# EasyEDA Pro project 2025NUEDC_A_Project.eprj, board PCB_互感器
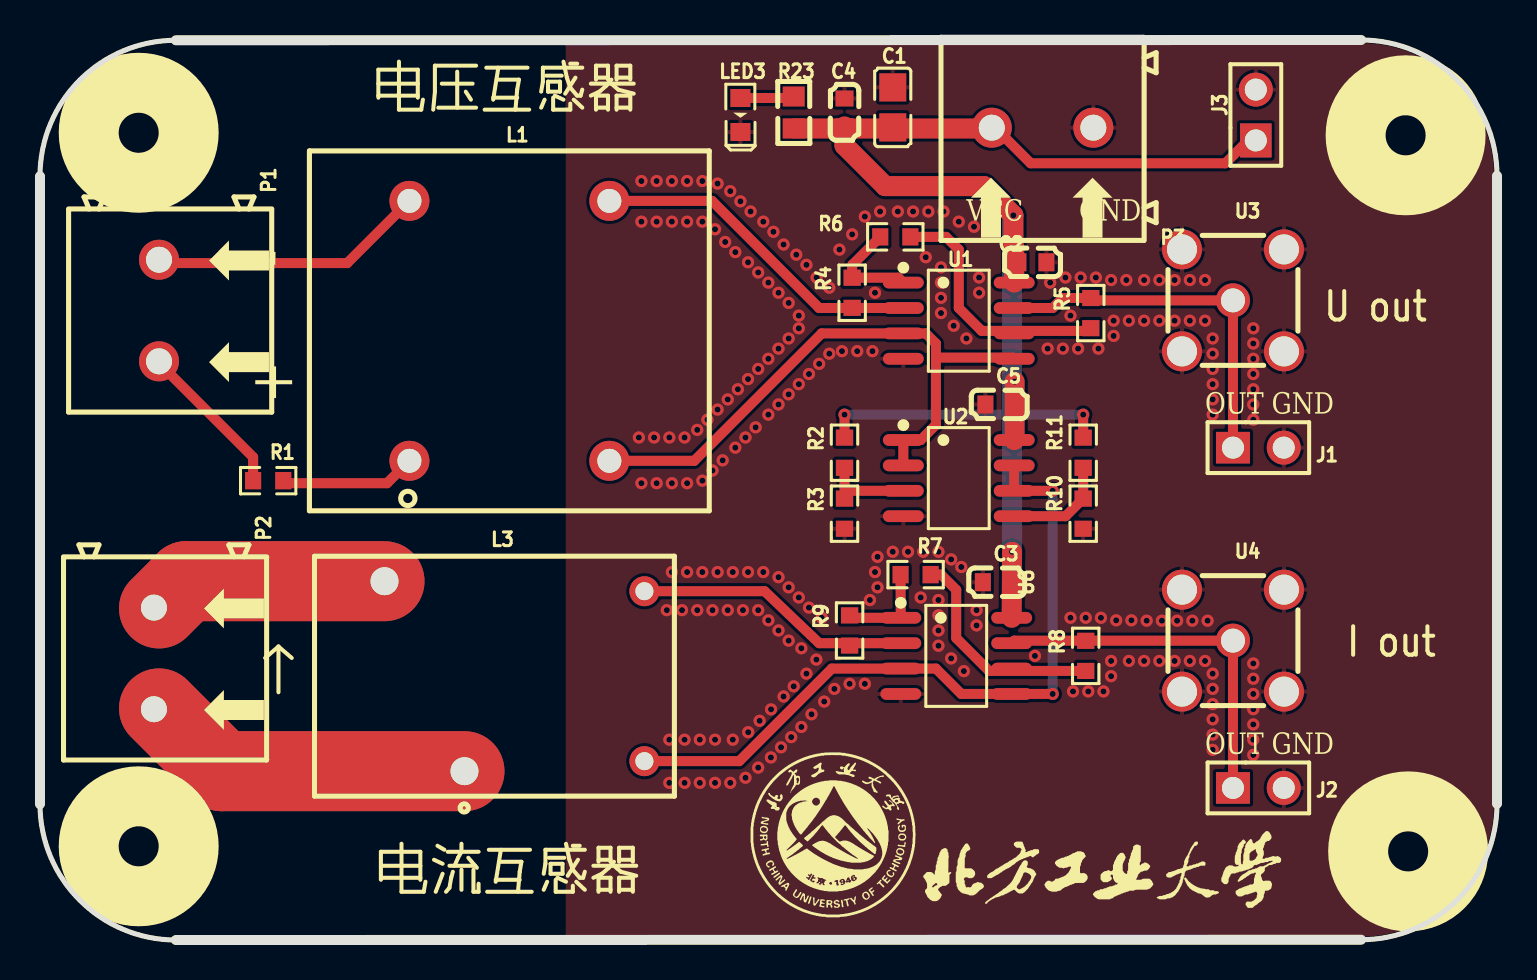
[diagram p7: board, top side]
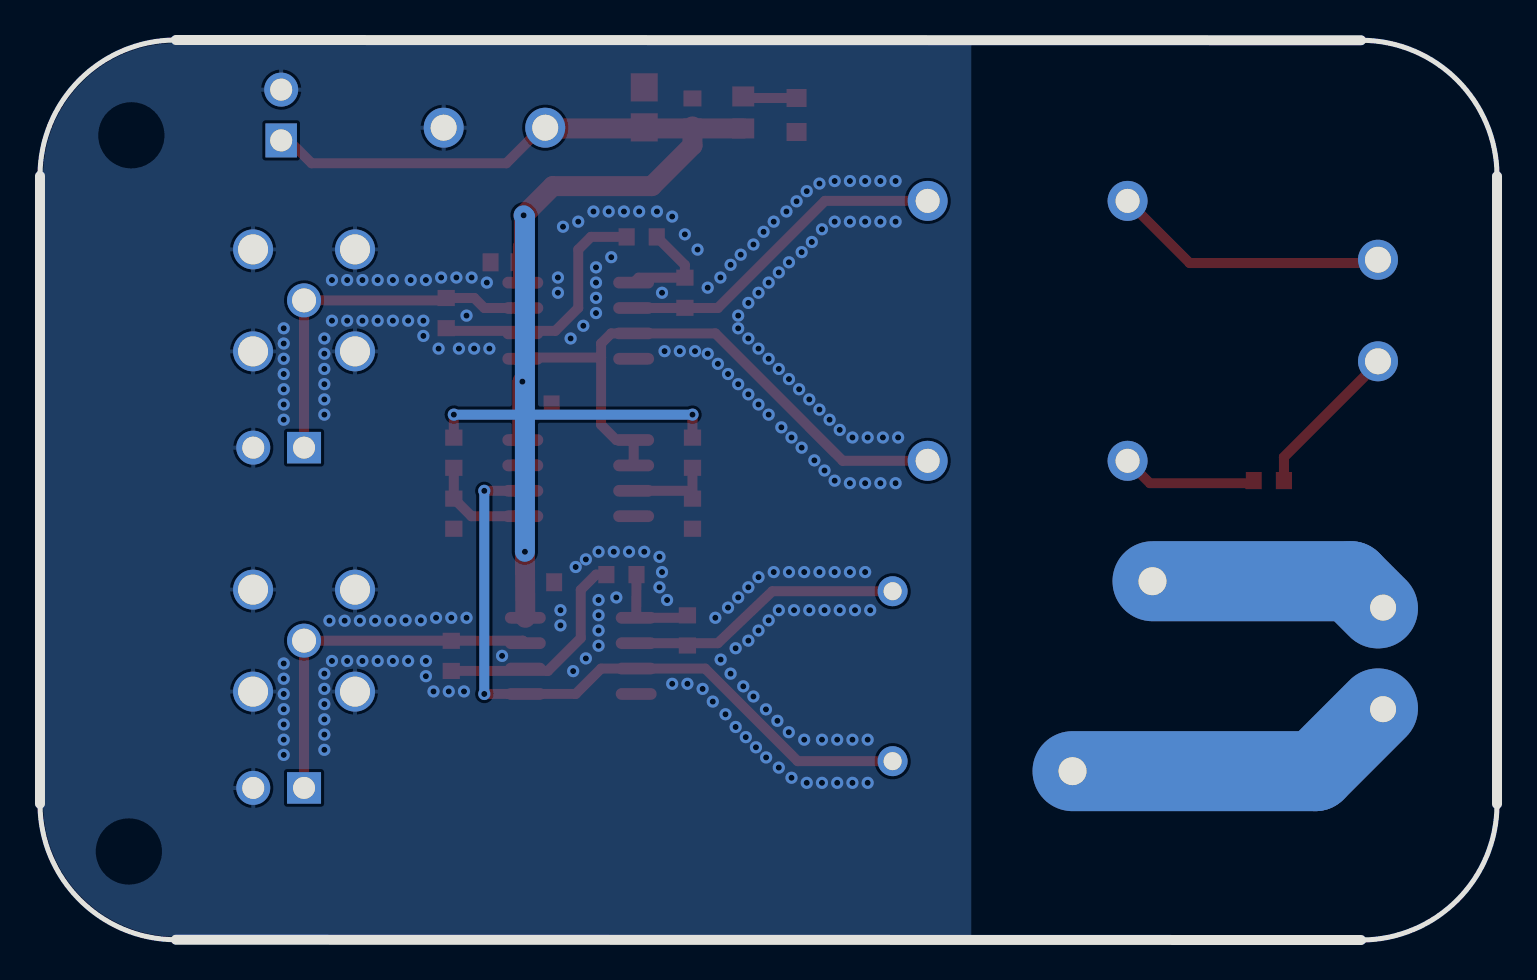
[diagram p8: board, bottom side, seen from below]

Outline 72.88 x 45.01 mm; copper layers: Top Layer, Bottom Layer. Coordinates in mm from the lower left corner of the outline.
Outline path: 0,38.2 arc(1.99,43.01) 6.8,45 66.08,45.01 arc(70.89,43.02) 72.88,38.21 72.88,6.81 arc(70.89,2.01) 66.08,0.01 6.8,0 arc(1.99,1.99) 0,6.8 0,38.2
Stack: Top Layer 0.035mm / Dielectric1 1.51mm FR4 er 4.5 / Bottom Layer 0.035mm

## Design rules (mm)
spacing Default (default): track to track 0.152, other pairs 0 to 0.152
track width Default (default): min 0.254, default 0.254, max 25.4
differential pair differentialPair (default): width min 0.127, default 0.254, max 2.54; gap min 0.152, default 0.152
via Default (default): diameter min 0.61, default 0.61, max 100.025; hole min 0.305, default 0.305, max 59.995
pour e10 uses gge4651
pour e101 uses gge4651(1)

## Placement (name value [footprint] x y rotation side)
C1  10u  [C0805]  42.66 41.64 270 top
C2  0.1u  [C0603]  49.64 33.9 180 top
C3  0.1u  [C0603]  47.86 17.89 0 top
C4  0.1u  [C0603]  40.24 41.39 270 top
C5  0.1u  [C0603]  47.99 26.78 0 top
J1  HDR-M-2.54_1x2  [HDR-M-2.54_1X2]  60.94 24.62 0 top
J2  HDR-M-2.54_1x2  [HDR-M-2.54_1X2]  60.94 7.61 0 top
J3  HDR-M-2.54_1x2  [HDR-M-2.54_1X2]  60.82 41.26 90 top
L1  ZMPT112  [XFMR-TH_ZMPT112]  23.48 30.47 0 top
L3  ZEMCT131  [IND-TH_ZEMCT131]  23.73 13.19 0 top
LED3  LED-0603_R  [LED0603_RED]  35.04 41.26 270 top
P1  WJ500V-5.08-2P  [CONN-TH_2P-P5.00_WJ500V-5.08-2P]  5.95 31.48 270 top
P2  WJ500V-5.08-2P  [CONN-TH_2P-P5.00_WJ500V-5.08-2P]  5.7 14.08 270 top
P3  WJ500V-5.08-2P  [CONN-TH_2P-P5.00_WJ500V-5.08-2P]  50.15 40.63 180 top
R1  180k  [R0603]  11.41 22.97 0 top
R2  1k  [R0603]  40.24 24.37 90 top
R3  1k  [R0603]  40.24 21.32 90 top
R4  50  [R0603]  40.62 32.37 90 top
R5  13k  [R0603]  52.56 31.36 90 top
R6  1k  [R0603]  42.78 35.17 0 top
R7  1k  [R0603]  43.8 18.28 0 top
R8  10k  [R0603]  52.31 14.21 90 top
R9  50  [R0603]  40.5 15.48 90 top
R10  1k  [R0603]  52.18 21.32 90 top
R11  1k  [R0603]  52.18 24.37 90 top
R23  1k  [R0603#2]  37.7 41.39 270 top
U1  MCP6022-E/SN  [SOIC-8_L4.9-W3.9-P1.27-LS6.0-BL]  45.96 30.97 270 top
U2  MCP6022-E/SN  [SOIC-8_L4.9-W3.9-P1.27-LS6.0-BL]  45.96 23.1 270 top
U3  SMA-JE-347A-H13.5-L5.3  [SMA-TH_HC-SMA6565-13H-G]  59.68 31.99 0 top
U4  SMA-JE-347A-H13.5-L5.3  [SMA-TH_HC-SMA6565-13H-G]  59.68 14.97 0 top
U6  MCP6022-E/SN  [SOIC-8_L4.9-W3.9-P1.27-LS6.0-BL]  45.83 14.21 270 top

## Footprints (pads in the part's own frame, mm; a bottom-side part is the same pattern mirrored in y, then rotated)
C0603
  rect 0.8x0.9 smd: 1(-0.7,0) 2(0.7,0)
C0805
  rect 1.41x1.35 smd: 1(-1,0) 2(1,0)
CONN-TH_2P-P5.00_WJ500V-5.08-2P
  round 2 hole 1.3: 1(-2.54,0) 2(2.54,0)
HDR-M-2.54_1X2
  rect 1.7x1.575 hole 1.1: 1(-1.27,0)
  round 1.7 hole 1.1: 2(1.27,0)
IND-TH_ZEMCT131
  round 2 hole 1.4: 1(-2.5,-4.75) 2(-6.5,4.75)
  round 1.5 hole 0.9: 3(6.5,4.25) 4(6.5,-4.25)
LED0603_RED
  rect 0.9x1 smd: 1(-0.85,0) 2(0.85,0)
R0603
  rect 0.806x0.864 smd: 1(-0.753,0) 2(0.753,0)
R0603#2
  rect 1x1.1 smd: 1(-0.8,0) 2(0.8,0)
SMA-TH_HC-SMA6565-13H-G
  round 2 hole 1.5: 1(-2.55,2.55) 2(2.55,2.55) 3(2.55,-2.55) 4(-2.55,-2.55)
  round 1.7 hole 1.2: 5(0,0)
SOIC-8_L4.9-W3.9-P1.27-LS6.0-BL
  oval 0.588x2.045 smd: 1(-1.905,-2.772) 2(-0.635,-2.772) 3(0.635,-2.772) 4(1.905,-2.772) 5(1.905,2.772) 6(0.635,2.772) 7(-0.635,2.772) 8(-1.905,2.772)
XFMR-TH_ZMPT112
  round 2 hole 1.2: 1(-5,-6.5) 2(-5,6.5) 3(5,6.5) 4(5,-6.5)

## Nets
As in the schematic.

## Via types
v1: diameter 0.61, hole 0.305, Top Layer to Bottom Layer, 234 vias

## Routing (per net, layer and track width the routed paths; a pad name or vN(x,y) marks a point on that pad's centre or on a via; arc(x,y) is an arc through that point)
3V3: length 76.2
  Top Layer w0.5: 47.4,41.01 49.56,38.85 59.29,38.85 60.44,39.99 J3.1 ; R11.2 v1(52.18,26.28) ; R2.2 v1(40.24,26.28)
  Top Layer w1: 40.24,40.59 40.24,39.74 42.28,37.71 47.23,37.71 v1(48.69,36.24) 48.69,34.66 48.73,34.62 U1.8 ; 40.24,40.59 C4.2 ; 40.24,40.59 46.98,40.59 47.4,41.01 ; 40.24,40.59 R23.2 ; U2.8 48.75,25.03 v1(48.75,27.93) ; 48.61,16.12 v1(48.63,19.42)
  Bottom Layer w0.5: v1(40.24,26.28) v1(52.18,26.28)
  Bottom Layer w1: v1(48.69,36.24) 48.63,36.18 v1(48.63,19.42)
GND:
  vias: v1(29.96,25.13) v1(30.08,37.96) v1(30.08,35.93) v1(30.08,22.85) v1(30.72,25.13) v1(30.85,37.96) v1(30.85,35.93) v1(30.85,22.85) v1(31.35,16.5) v1(31.48,25.13) v1(31.48,10.02) v1(31.48,7.86) v1(31.61,37.96) v1(31.61,35.93) v1(31.61,22.85) v1(31.61,18.4) v1(32.12,16.5) v1(32.24,25.13) v1(32.24,10.02) v1(32.24,7.86) v1(32.37,37.96) v1(32.37,35.93) v1(32.37,22.85) v1(32.37,18.4) v1(32.88,25.51) v1(32.88,16.5) v1(33,10.02) v1(33,7.86) v1(33.13,37.96) v1(33.13,35.93) v1(33.13,22.97) v1(33.13,18.4) v1(33.39,26.02) v1(33.64,23.48) v1(33.64,16.5) v1(33.77,35.55) v1(33.77,10.02) v1(33.77,7.86) v1(33.89,37.83) v1(33.89,26.53) v1(33.89,18.4) v1(34.15,23.99) v1(34.28,34.91) v1(34.4,27.04) v1(34.4,16.5) v1(34.53,37.45) v1(34.53,7.86) v1(34.66,18.4) v1(34.66,10.02) v1(34.78,34.4) v1(34.78,24.62) v1(34.91,27.55) v1(35.04,36.94) v1(35.16,16.5) v1(35.29,25.13) v1(35.29,8.11) v1(35.42,33.9) v1(35.42,28.05) v1(35.42,18.4) v1(35.43,10.39) v1(35.54,36.44) v1(35.8,25.64) v1(35.93,33.39) v1(35.93,28.56) v1(35.93,16.5) v1(35.93,8.62) v1(36,10.96) v1(36.18,35.93) v1(36.18,18.4) v1(36.43,32.88) v1(36.43,29.07) v1(36.43,26.28) v1(36.43,15.99) v1(36.57,11.54) v1(36.56,9.13) v1(36.69,35.42) v1(36.94,32.37) v1(36.94,29.58) v1(36.94,26.78) v1(36.94,18.15) v1(36.94,15.48) v1(37.07,9.64) v1(37.2,34.78) v1(37.2,12.18) v1(37.45,31.86) v1(37.45,30.09) v1(37.45,27.29) v1(37.45,17.64) v1(37.45,14.97) v1(37.58,10.15) v1(37.7,12.69) v1(37.83,34.28) v1(37.96,31.23) v1(37.96,30.59) v1(37.96,27.8) v1(37.96,17.13) v1(38.09,14.59) v1(38.09,10.66) v1(38.34,33.77) v1(38.34,13.32) v1(38.47,28.31) v1(38.47,16.62) v1(38.59,11.29) v1(38.85,33.13) v1(38.84,14.03) v1(38.97,28.82) v1(39.1,16.12) v1(39.23,11.92) v1(39.48,32.63) v1(39.48,29.32) v1(39.74,12.56) v1(39.99,34.53) v1(40.12,29.45) v1(40.5,12.81) v1(40.62,35.29) v1(40.88,29.45) v1(41.26,36.18) v1(41.26,12.81) v1(41.51,17) v1(41.64,29.45) v1(41.77,32.37) v1(41.77,18.4) v1(41.9,19.16) v1(41.9,17.64) v1(42.02,36.44) v1(42.66,19.42) v1(42.91,36.44) v1(43.42,19.42) v1(43.67,36.44) v1(44.05,17.13) v1(44.18,19.42) v1(44.31,34.15) v1(44.44,36.44) v1(44.94,19.42) v1(44.94,17) v1(44.94,16.24) v1(44.94,15.48) v1(44.94,14.72) v1(45.07,33.64) v1(45.07,32.88) v1(45.07,32.12) v1(45.07,31.36) v1(45.2,36.44) v1(45.58,19.04) v1(45.58,14.08) v1(45.71,30.72) v1(45.96,35.93) v1(46.09,18.66) v1(46.21,13.45) v1(46.34,30.09) v1(46.72,35.67) v1(46.85,16.5) v1(46.85,15.73) v1(46.97,33.13) v1(46.97,32.37) v1(49.77,14.21) v1(50.4,29.58) v1(50.53,32.88) v1(51.17,29.58) v1(51.29,33.13) v1(51.55,31.23) v1(51.55,16.12) v1(51.67,12.43) v1(51.93,29.58) v1(52.06,33.13) v1(52.31,16.12) v1(52.44,12.43) v1(52.82,33.13) v1(52.94,29.58) v1(53.07,16.12) v1(53.2,12.43) v1(53.58,33.01) v1(53.58,13.96) v1(53.58,13.19) v1(53.71,30.97) v1(53.71,30.21) v1(53.83,15.99) v1(54.34,33.01) v1(54.47,30.97) v1(54.47,13.96) v1(54.59,15.99) v1(55.23,33.01) v1(55.23,30.97) v1(55.23,13.96) v1(55.36,15.97) v1(55.99,33.01) v1(55.99,30.97) v1(55.99,13.96) v1(56.12,15.97) v1(56.75,33.01) v1(56.75,30.97) v1(56.75,13.96) v1(56.88,15.97) v1(57.52,33.01) v1(57.52,30.97) v1(57.52,13.96) v1(57.64,15.97) v1(58.28,33.01) v1(58.28,30.97) v1(58.28,13.96) v1(58.41,15.97) v1(58.66,30.09) v1(58.66,29.32) v1(58.66,28.56) v1(58.66,27.8) v1(58.66,27.04) v1(58.66,26.28) v1(58.66,13.32) v1(58.66,12.56) v1(58.66,11.8) v1(58.66,11.04) v1(58.66,10.27) v1(58.66,9.51) v1(60.69,30.59) v1(60.69,29.83) v1(60.69,29.07) v1(60.69,28.31) v1(60.69,27.55) v1(60.69,26.78) v1(60.69,26.02) v1(60.69,13.83) v1(60.69,13.07) v1(60.69,12.31) v1(60.69,11.54) v1(60.69,10.78) v1(60.69,10.02) v1(60.69,9.26)
$1N1105: length 4.2
  Top Layer w0.5: R2.1 R3.2 ; U2.3 40.5,22.47
$1N1106: length 30.4
  Top Layer w0.5: 44.82,29.13 44.82,29.83 44.31,30.34 U1.3 39.1,30.34 32.73,23.97 L1.4 ; 44.82,29.13 48.67,29.13 U1.5 ; 44.82,29.13 44.82,25.77 44.05,25.01 U2.1 U2.2
$1N1107: length 16.9
  Top Layer w0.5: L1.3 33.62,36.97 38.97,31.61 U1.2
$1N1108: length 5.3
  Top Layer w0.5: U1.1 42.94,33.13 R4.2 40.62,33.76 R6.1
$1N1109: length 12.3
  Top Layer w0.5: R6.2 45.32,35.17 45.96,34.53 45.96,31.61 47.1,30.47 52.18,30.47
$1N1110: length 18.6
  Top Layer w0.5: U1.7 50.66,31.61 51.16,32.11 R5.2 52.68,31.99 U3.5 59.68,24.62
$1N1113: length 13.9
  Top Layer w0.5: L3.3 36.25,17.44 38.97,14.85 U6.2
$1N1114: length 18.5
  Top Layer w0.5: U4.5 48.73,14.97 U6.7 ; 59.68,7.61 59.68,14.85 59.8,14.97
$1N1115: length 11.2
  Top Layer w0.5: R7.2 45.07,18.28 45.83,17.51 45.83,15.1 47.47,13.46 R8.1
$1N1116: length 36.2
  Top Layer w0.5: v1(50.66,22.47) U2.6 U2.7 ; v1(50.66,12.31) U6.5 46.09,12.31 44.82,13.58 U6.3 39.61,13.58 34.98,8.94 L3.4
  Bottom Layer w0.5: v1(50.66,12.31) v1(50.66,22.47)
$1N1117: length 4.8
  Top Layer w0.5: R9.2 40.62,16.12 43.06,16.12 R7.1
$1N1118: length 5.4
  Top Layer w0.5: R11.1 R10.2 51.3,21.2 U2.5
$1N1123: length 2.7
  Top Layer w0.5: LED3.1 37.63,42.11 R23.1
$1N1128: length 6.4
  Top Layer w0.5: 12.56,22.85 17.36,22.85 L1.1
$1N2942: length 13.8
  Top Layer w0.5: L1.2 15.37,33.86 5.95,33.86
$1N2947: length 7.8
  Top Layer w0.5: R1.1 10.66,24.15 5.95,28.86
$1N2968: length 33.2
  Top Layer w4: 5.95,11.58 9.09,8.44 L3.1
  Bottom Layer w4: L3.1 9.09,8.44 5.95,11.58
$1N2974: length 23.7
  Top Layer w4: L3.2 7.31,17.94 5.95,16.58
  Bottom Layer w4: L3.2 7.31,17.94 5.95,16.58

## Copper pours and planes (outline as drawn; the poured copper is in the pictures)
GND on Top Layer: 25.51,49.01 26.4,48.12 26.4,-7.38 30.72,-3.06 81.14,-3.06 80,-1.92 80,49.14
GND on Bottom Layer: 25.51,49.26 26.4,48.37 26.4,-7.12 30.72,-2.81 81.14,-2.81 80,-1.66 80,49.39

## Text on the board
Top Silkscreen Layer: U out | I out | VCC       GND | OUT GND | → | 电压互感器 | 电流互感器 | -      +
